# Altium schematic sheet USB DV Stick 1V1_Sheet1.SchDoc: USB DV Stick
size B; CompanyName: LoneStar Designs; Organization: LoneStar Designs; Address1: 1005 Lela; Address2: McKinney, Texas 75069; DocumentNumber: 190724-1; Revision: 1V1; SheetNumber: 1; SheetTotal: 3
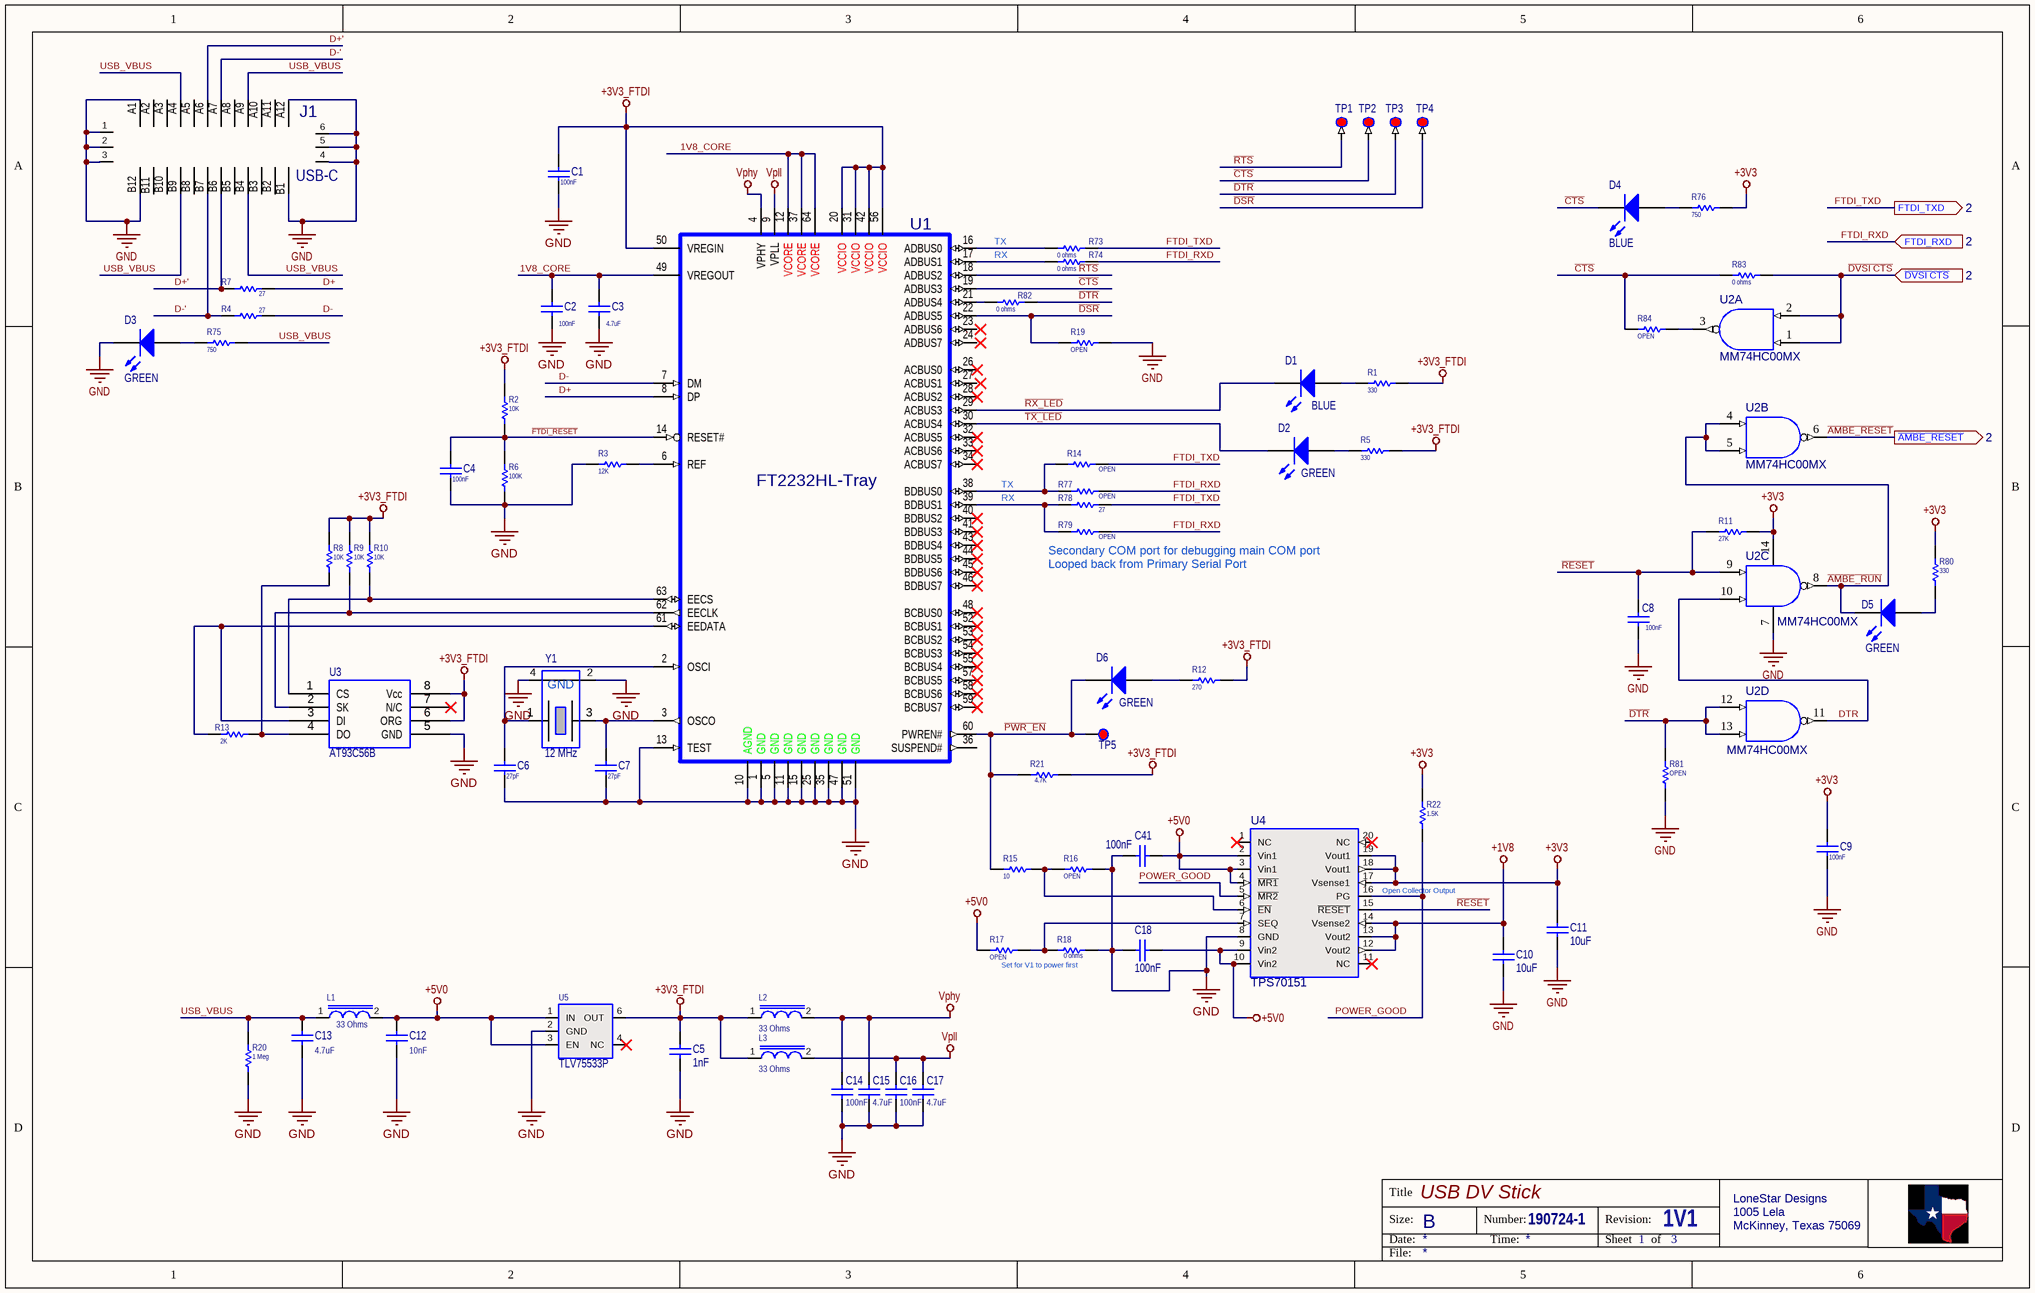
[diagram p0: USB DV Stick 1V1_Sheet1.SchDoc]

## Parts
C1  100nF  [C0402]
C2  100nF  [C0402]
C3  4.7uF  [C0603]
C4  100nF  [C0402]
C5  1nF  [C0402]
C6  27pF  [C0402]
C7  27pF  [C0402]
C8  100nF  [C0402]
C9  100nF  [C0402]
C10  10uF  [C0805]
C11  10uF  [C0805]
C12  10nF  [C0402]
C13  4.7uF  [C0603]
C14  100nF  [C0402]
C15  4.7uF  [C0603]
C16  100nF  [C0402]
C17  4.7uF  [C0603]
C18  100nF  [C0402]
C41  100nF  [C0603]
D1  BLUE  [LED0603]
D2  GREEN  [LED0603]
D3  GREEN  [LED0603]
D4  BLUE  [LED0603]
D5  GREEN  [LED0603]
D6  GREEN  [LED0603]
J1  USB-C  [USB-C]
L1  33 Ohms  [C0603]
L2  33 Ohms  [C0603]
L3  33 Ohms  [C0603]
R1  330  [R0603]
R2  10K  [R0603]
R3  12K  [R0603]
R4  27  [R0603]
R5  330  [R0603]
R6  100K  [R0603]
R7  27  [R0603]
R8  10K  [R0603]
R9  10K  [R0603]
R10  10K  [R0603]
R11  27K  [R0603]
R12  270  [R0603]
R13  2K  [R0603]
R14  OPEN  [R0603]
R15  10  [R0603]
R16  OPEN  [R0603]
R17  OPEN  [R0603]
R18  0 ohms  [R0603]
R19  OPEN  [R0603]
R20  1 Meg  [R0603]
R21  4.7K  [R0603]
R22  1.5K  [R0603]
R73  0 ohms  [R0603]
R74  0 ohms  [R0603]
R75  750  [R0603]
R76  750  [R0603]
R77  OPEN  [R0603]
R78  27  [R0603]
R79  OPEN  [R0603]
R80  330  [R0603]
R81  OPEN  [R0603]
R82  0 ohms  [R0603]
R83  0 ohms  [R0603]
R84  OPEN  [R0603]
TP1  5015  [TP SM]  (value not drawn)
TP2  5015  [TP SM]  (value not drawn)
TP3  5015  [TP SM]  (value not drawn)
TP4  5015  [TP SM]  (value not drawn)
TP5  5015  [TP SM]  (value not drawn)
U1  FT2232HL-Tray  [FT2232HL]
U2  MM74HC00MX  [D014_L]  (parts A,B,C,D of 4)
U3  AT93C56B  [SO8_M]
U4  TPS70151  [TTSOP-20 (PW)]
U5  TLV75533P  [SOT23-6_M]
Y1  12 MHz  [OSC_ECS-TXO-2033]  (value not drawn)

## Ports
FTDI_RXD (in, see 2), FTDI_TXD (out, see 2), ~{AMBE_RESET} (out, see 2), ~{DVSI CTS} (in, see 2)

## Nets
+1V8: C10.2 U4.12(Vout2) U4.13(Vout2) U4.14(Vsense2)
+3V3: C9.2 C11.2 R11.1 R22.2 R76.2 R80.2 U2.14(VCC) U4.17(Vsense1) U4.18(Vout1) U4.19(Vout1)
+3V3_FTDI: C1.2 C5.2 L2.1 L3.1 R1.2 R2.2 R5.2 R8.2 R9.2 R10.2 R12.2 R21.1 U1.20(VCCIO) U1.31(VCCIO) U1.42(VCCIO) U1.50(VREGIN) U1.56(VCCIO) U3.6(ORG) U3.8(Vcc) U5.6(OUT)
+5V0: C12.2 C18.1 C41.2 L1.2 R17.1 U4.2(Vin1) U4.3(Vin1) U4.4(~{MR1}) U4.9(Vin2) U4.10(Vin2) U5.1(IN) U5.3(EN)
GND: C1.1 C2.1 C3.1 C4.1 C5.1 C6.1 C7.1 C8.1 C9.1 C10.1 C11.1 C12.1 C13.1 C14.1 C15.1 C16.1 C17.1 C18.2 C41.1 D3.2(K) J1.1 J1.2 J1.3 J1.4 J1.5 J1.6 J1.A1 J1.A12 J1.B1 J1.B12 R3.1 R6.1 R16.2 R18.2 R19.1 R20.1 R81.1 U1.1(GND) U1.5(GND) U1.10(AGND) U1.11(GND) U1.13(TEST) U1.15(GND) U1.25(GND) U1.35(GND) U1.47(GND) U1.51(GND) U2.7(GND) U3.5(GND) U4.8(GND) U5.2(GND) Y1.2(GND) Y1.4
Vphy: C14.2 C15.2 L2.2 U1.4(VPHY)
Vpll: C16.2 C17.2 L3.2 U1.9(VPLL)
1V8_CORE: C2.2 C3.2 U1.12(VCORE) U1.37(VCORE) U1.49(VREGOUT) U1.64(VCORE)
~{AMBE_RESET}: U2.6(Y) ; port ~{AMBE_RESET}
~{AMBE_RUN}: D5.2(K) U2.4(A) U2.5(B) U2.8(Y)
~{CTS}: D4.2(K) R83.1 R84.1 TP2.1 U1.19(ADBUS3)
~{DSR}: R19.2 TP4.1 U1.22(ADBUS5)
~{DTR}: R81.2 R82.2 TP3.1 U2.12(A) U2.13(B)
~{DVSI CTS}: R83.2 U2.1(A) U2.2(B) ; port ~{DVSI CTS}
~{FTDI_RESET}: C4.2 R2.1 R6.2 U1.14(RESET#)
~{PWR_EN}: D6.2(K) R15.1 R21.2 TP5.1 U1.60(PWREN#)
~{RESET}: C8.2 R11.2 U2.9(A) U4.15(~{RESET})
~{RTS}: TP1.1 U1.18(ADBUS2)
~{RX_LED}: D1.2(K) U1.29(ACBUS3)
~{TX_LED}: D2.2(K) U1.30(ACBUS4)
D+: R7.2 U1.8(DP)
D+': J1.A6 J1.B6 R7.1
D-: R4.2 U1.7(DM)
D-': J1.A7 J1.B7 R4.1
DTR: U2.10(B) U2.11(Y)
FTDI_RXD: R74.2 R77.2 R79.2 ; port FTDI_RXD
FTDI_TXD: R14.1 R73.2 R78.2 ; port FTDI_TXD
POWER_GOOD: R22.1 U4.5(~{MR2}) U4.16(PG)
USB_VBUS: C13.2 J1.A4 J1.A9 J1.B4 J1.B9 L1.1 R20.2 R75.2
NetC6_2: C6.2 U1.2(OSCI) Y1.1
NetC7_2: C7.2 U1.3(OSCO) Y1.3
NetD1_1: D1.1(A) R1.1
NetD2_1: D2.1(A) R5.1
NetD3_1: D3.1(A) R75.1
NetD4_1: D4.1(A) R76.1
NetD5_1: D5.1(A) R80.1
NetD6_1: D6.1(A) R12.1
NetR3_2: R3.2 U1.6(REF)
NetR8_1: R8.1 R13.2 U3.4(DO)
NetR9_1: R9.1 U1.62(EECLK) U3.2(SK)
NetR10_1: R10.1 U1.63(EECS) U3.1(CS)
NetR13_1: R13.1 U1.61(EEDATA) U3.3(DI)
NetR14_2: R14.2 R77.1 U1.38(BDBUS0)
NetR15_2: R15.2 R16.1 U4.6(~{EN})
NetR17_2: R17.2 R18.1 U4.7(SEQ)
NetR73_1: R73.1 U1.16(ADBUS0)
NetR74_1: R74.1 U1.17(ADBUS1)
NetR78_1: R78.1 R79.1 U1.39(BDBUS1)
NetR82_1: R82.1 U1.21(ADBUS4)
NetR84_2: R84.2 U2.3(Y)

Not connected (* = marked no-connect by the designer): J1 A2 A3 A5 A8 A10 A11 B2 B3 B5 B8 B10 B11; U1 23(ADBUS6) 24(ADBUS7) 26(ACBUS0)* 27(ACBUS1) 28(ACBUS2)* 32(ACBUS5)* 33(ACBUS6)* 34(ACBUS7)* 36(SUSPEND#) 40(BDBUS2)* 41(BDBUS3)* 43(BDBUS4)* 44(BDBUS5)* 45(BDBUS6)* 46(BDBUS7)* 48(BCBUS0)* 52(BCBUS1)* 53(BCBUS2)* 54(BCBUS3)* 55(BCBUS4)* 57(BCBUS5)* 58(BCBUS6)* 59(BCBUS7)*; U3 7(N/C)*; U4 1(NC)* 11(NC)* 20(NC)*; U5 4(NC)*

## Notes on the sheet
- TX
- RX
- (near R79) Secondary COM port for debugging main COM port
- (near R79) Looped back from Primary Serial Port
- (near U4) Open Collector Output
- Set for V1 to power first
- Title
- Size:
- Date:
- B
- Number:
- Time:
- Revision:
- Sheet
- of
- File:

## Library data of the parts
C1 C2 C4 C8 C9 C14 C16 C18 = Cap SM: Capacitor Surface Mount; Manufacturer: Murata Electronics; Manufacturer Part Number: GRM155R61H104KE19D; PackageReference: C0603; PackageDescription: Chip Capacitor; Value: 100nF; Supplier 1: Mouser; Supplier Part Number 1: 81-GRM155R61H104KE9D
C3 C13 C15 C17 = Cap SM: Capacitor Surface Mount; Manufacturer: Taiyo Yuden; Manufacturer Part Number: TMK107BBJ475MA-T; PackageReference: C0603; PackageDescription: Chip Capacitor; Value: 4.7uF; Supplier 1: Mouser; Supplier Part Number 1: 963-TMK107BBJ475MA-T
C5 = Cap SM: Capacitor Surface Mount; Manufacturer: Murata Electronics; Manufacturer Part Number: GCM1555C1H102JA16J; PackageReference: C0402; PackageDescription: Chip Capacitor; Value: 1nF; Supplier 1: Mouser; Supplier Part Number 1: 81-GCM1555C1H102JA6J
C6 C7 = Cap SM: Capacitor Surface Mount; Manufacturer: Murata Electronics; Manufacturer Part Number: GCM1555C1H270FA16D; PackageReference: C0603; PackageDescription: Chip Capacitor; Value: 27pF; Supplier 1: Mouser; Supplier Part Number 1: 81-GCM1555C1H270FA6D
C10 C11 = Cap SM: Capacitor Surface Mount; Manufacturer: Murata Electronics; Manufacturer Part Number: GRJ21BR61E106KE01K; PackageReference: C0603; PackageDescription: Chip Capacitor; Value: 10uF; Supplier 1: Mouser; Supplier Part Number 1: 81-GRJ21BR61E106KE1K
C12 = Cap SM: Capacitor Surface Mount; Manufacturer: Murata Electronics; Manufacturer Part Number: GCM155R71H103KA55D; PackageReference: C0402; PackageDescription: Chip Capacitor; Value: 10nF; Supplier 1: Mouser; Supplier Part Number 1: 81-GCM155R71H103KA5D
C41 = Cap SM: Capacitor Surface Mount; Manufacturer: Murata Electronics; Manufacturer Part Number: GRM033C71C104KE14D; LatestRevisionDate: 08/13/2019; LatestRevisionNote: IPC-7351 Footprint Added.; PackageReference: C0603; PackageDescription: Chip Capacitor; Value: 100nF; Supplier 1: Mouser; Supplier 1 Part Number: *; Supplier Part Number 1: 81-GRM33C71C104KE14D
D1 D4 = LED 0603 BLUE: BLUE in 0603 package; Manufacturer: Kingbright; Manufacturer Part Number: APT1608QBC/D; PackageDescription: SM LED; 0603 package; Supplier 1: Mouser; Supplier Part Number 1: 604-APT1608QBC/D; Value: BLUE; PackageReference: R0603
D2 D3 D5 D6 = LED 0603 GREEN: GREEN in 0603 package; Manufacturer: Kingbright; Manufacturer Part Number: APT1608CGCK; PackageDescription: SM LED; 0603 package; Supplier 1: Mouser; Supplier Part Number 1: 604-APT1608CGCK; Value: GREEN; PackageReference: R0603
J1 = USB-C ( through hole ): USB Type C with through holes; Manufacturer: Würth Elektronik; Manufacturer Part Number: 632 723 300 311; Supplier 1: Mouser; Supplier Part Number 1: 710-632723300011; Value: USB-C; PackageDescription: USB-C; PackageReference: USB-C
L1-L3 = Ferrite Bead ( 0603 ): Standard Ferrite Bead in 0603 package; Manufacturer: Taiyo Yuden; Manufacturer Part Number: BKP1608HS121-T; Value: 33 Ohms; Supplier 1: Mouser; Supplier Part Number 1: 963-BKP1608HS121-T; PackageDescription: Ferrite Bead; PackageReference: C0603
R1 R5 R80 = RES SM: Resistor Surface Mount; Manufacturer: Vishay / Dale; Manufacturer Part Number: CRCW0603330RFKEBC; PackageReference: R0603; PackageDescription: Surface Mount; Value: 330; Supplier 1: Mouser; Supplier Part Number 1: 71-CRCW0603330RFKEBC
R2 R8-R10 = RES SM: Resistor Surface Mount; Manufacturer: Vishay / Dale; Manufacturer Part Number: CRCW060310K0FKEAC; PackageReference: R0603; PackageDescription: Surface Mount; Value: 10K; Supplier 1: Mouser; Supplier Part Number 1: 71-CRCW060310K0FKEAC
R3 = RES SM: Resistor Surface Mount; Manufacturer: Vishay / Dale; Manufacturer Part Number: CRCW060312K1FKEAC; PackageReference: R0603; PackageDescription: Surface Mount; Value: 12K; Supplier 1: Mouser; Supplier Part Number 1: 71-CRCW060312K1FKEAC
R4 R7 R78 = RES SM: Resistor Surface Mount; Manufacturer: Vishay / Dale; Manufacturer Part Number: RCS060327R0FKEA; PackageReference: R0603; PackageDescription: Surface Mount; Value: 27; Supplier 1: Mouser; Supplier Part Number 1: 71-RCS060327R0FKEA
R6 = RES SM: Resistor Surface Mount; Manufacturer: Vishay / Dale; Manufacturer Part Number: CRCW0603100KJNEAC; PackageReference: R0603; PackageDescription: Surface Mount; Value: 100K; Supplier 1: Mouser; Supplier Part Number 1: 71-CRCW0603100KJNEAC
R11 = RES SM: Resistor Surface Mount; Manufacturer: Vishay / Dale; Manufacturer Part Number: CRCW060327K0FKEAC; PackageReference: R0603; PackageDescription: Surface Mount; Value: 27K; Supplier 1: Mouser; Supplier Part Number 1: 71-CRCW060327K0FKEAC
R12 = RES SM: Resistor Surface Mount; Manufacturer: Vishay / Dale; Manufacturer Part Number: RCS0603270RFKEA; PackageReference: R0603; PackageDescription: Surface Mount; Value: 270; Supplier 1: Mouser; Supplier Part Number 1: 71-RCS0603270RFKEA
R13 = RES SM: Resistor Surface Mount; Manufacturer: Vishay / Dale; Manufacturer Part Number: CRCW06032K00FKEAC; PackageReference: R0603; PackageDescription: Surface Mount; Value: 2K; Supplier 1: Mouser; Supplier Part Number 1: 71-CRCW06032K00FKEAC
R14 R16 R17 R19 R77 R79 R81 R84 = RES SM: Resistor Surface Mount; PackageReference: R0603; PackageDescription: Surface Mount; Value: OPEN; Manufacturer: N/A; Manufacturer Part Number: N/A; Supplier Part Number 1: N/A
  R14 R16 R17 R19 R77 R79 R81: Supplier 1: N/A
  R84: Supplier 1: Mouser
R15 = RES SM: Resistor Surface Mount; Manufacturer: Vishay / Dale; Manufacturer Part Number: CRCW060310R0FKEAC; PackageReference: R0603; PackageDescription: Surface Mount; Value: 10; Supplier 1: Mouser; Supplier Part Number 1: 71-CRCW060310R0FKEAC
R18 R73 R74 R82 R83 = RES SM: Resistor Surface Mount; Manufacturer: Vishay / Dale; Manufacturer Part Number: CRCW06030000Z0EAC; PackageReference: R0603; PackageDescription: Surface Mount; Value: 0 ohms; Supplier 1: Mouser; Supplier Part Number 1: 71-CRCW06030000Z0EAC
R20 = RES SM: Resistor Surface Mount; Manufacturer: Panasonic; Manufacturer Part Number: ERJ-3EKF1004V; PackageReference: R0603; PackageDescription: Surface Mount; Value: 1 Meg; Supplier 1: Mouser; Supplier Part Number 1: 667-ERJ-3EKF1004V
R21 = RES SM: Resistor Surface Mount; Manufacturer: Vishay / Dale; Manufacturer Part Number: CRCW06034K70FKEA; PackageReference: R0603; PackageDescription: Surface Mount; Value: 4.7K; Supplier 1: Mouser; Supplier Part Number 1: 71-CRCW0603-4.7K-E3
R22 = RES SM: Resistor Surface Mount; Manufacturer: Vishay / Dale; Manufacturer Part Number: CRCW06031K50FKEAC; PackageReference: R0603; PackageDescription: Surface Mount; Value: 1.5K; Supplier 1: Mouser; Supplier Part Number 1: 71-CRCW06031K50FKEAC
R75 R76 = RES SM: Resistor Surface Mount; Manufacturer: Vishay / Dale; Manufacturer Part Number: CRCW0603750RFKEA; PackageReference: R0603; PackageDescription: Surface Mount; Value: 750; Supplier 1: Mouser; Supplier Part Number 1: 71-CRCW0603-750-E3
TP1-TP5 = Test Point: Surface Mount; Manufacturer: Keystone; Value: TP SM; Manufacturer Part Number: 5015; Supplier 1: Mouser; Supplier 2: Digi-Key; Supplier Part Number 1: 534-5015; Supplier Part Number 2: 36-5015CT-ND; PackageDescription: R0805; PackageReference: R0805
U1 = FT2232HL-Tray: Dual High Speed USB To Multipurpose UART/FIFO IC, LQFP-64, Tray; Manufacturer: FTDI; PackageReference: LQFP-64; PackageDescription: 64-Pin Thin Quad Flat Pack, 10 x 10 x 1.4 mm Body, 0.5 mm Pitch; ComponentLink1Description: Manufacturer Link; ComponentLink1URL: http://www.ftdichip.com/Products/ICs/FT2232H.htm; ComponentLink2Description: Datasheet; Supplier 1: Mouser; Supplier 2: Digi-Key; Supplier Part Number 1: 895-FT2232HL-TRAY; Supplier Part Number 2: 768-1347-ND; Value: FT2232HL-TR; Manufacturer Part Number: FT2232HL-TRAY
U2 = 74AS00D: Quadruple 2-Input Positive-NAND Gate; Manufacturer: ON / Fairchild; PackageReference: SOIC-14 Narrow; PackageDescription: 14-Pin Small Outline Integrated Circuit 1.27 mm Pitch; ComponentLink1Description: Manufacturer Link; ComponentLink1URL: https://www.mouser.com/datasheet/2/149/MM74HC00-1011083.pdf; ComponentLink2Description: Datasheet; Value: MM74HC00MX; Supplier 1: Mouser; Manufacturer Part Number: MM74HC00MX; Supplier Part Number 1: 512-MM74HC00MX
U3 = AT93C56B: 2Kb ( 256 x 8 ) Serial Memory; Manufacturer: Microship Technology; Manufacturer Part Number: AT93C56B-SSHM-B; Supplier 1: Mouser; Supplier Part Number 1: 556-AT93C56B-SSHM-B; Value: AT93C56B; PackageDescription: SO-8; PackageReference: SO-8
U4 = TPS70151: Dual Output low drop out regulator; Manufacturer Part Number: TPS70151PWP; Manufacturer: TI; Value: TPS70151; Supplier 1: Mouser; Supplier Part Number 1: 595-TPS70151PWP; PackageDescription: HTTSOP-20; PackageReference: TTSOP-20
U5 = TLV755P: 3.3V LDO in SOT-23-5 package  ( 500mA); Manufacturer Part Number: TLV75533PDBVR; Manufacturer: TI; Value: TLV75533P; Supplier 1: Mouser; Supplier Part Number 1: 595-TLV75533PDBVR; PackageDescription: SOT23-5; PackageReference: SOT23-5
Y1 = Xtal - 4 pin ( 12 MHz ): Surface Mount Crystal  ( 2.5 x 2.0 )  4 pin; Manufacturer: ECS; Manufacturer Part Number: ECS-120-10-36B-CWY-TR; Value: 12 MHz; Supplier Part Number 1: 520-120-10-36B-CWYT; Supplier 1: Mouser; PackageDescription: Xtal (2.5 x 2.0 mm ); PackageReference: 2.5 x 2.0